# EAGLE design underwater_final (EAGLE 9.5.2)
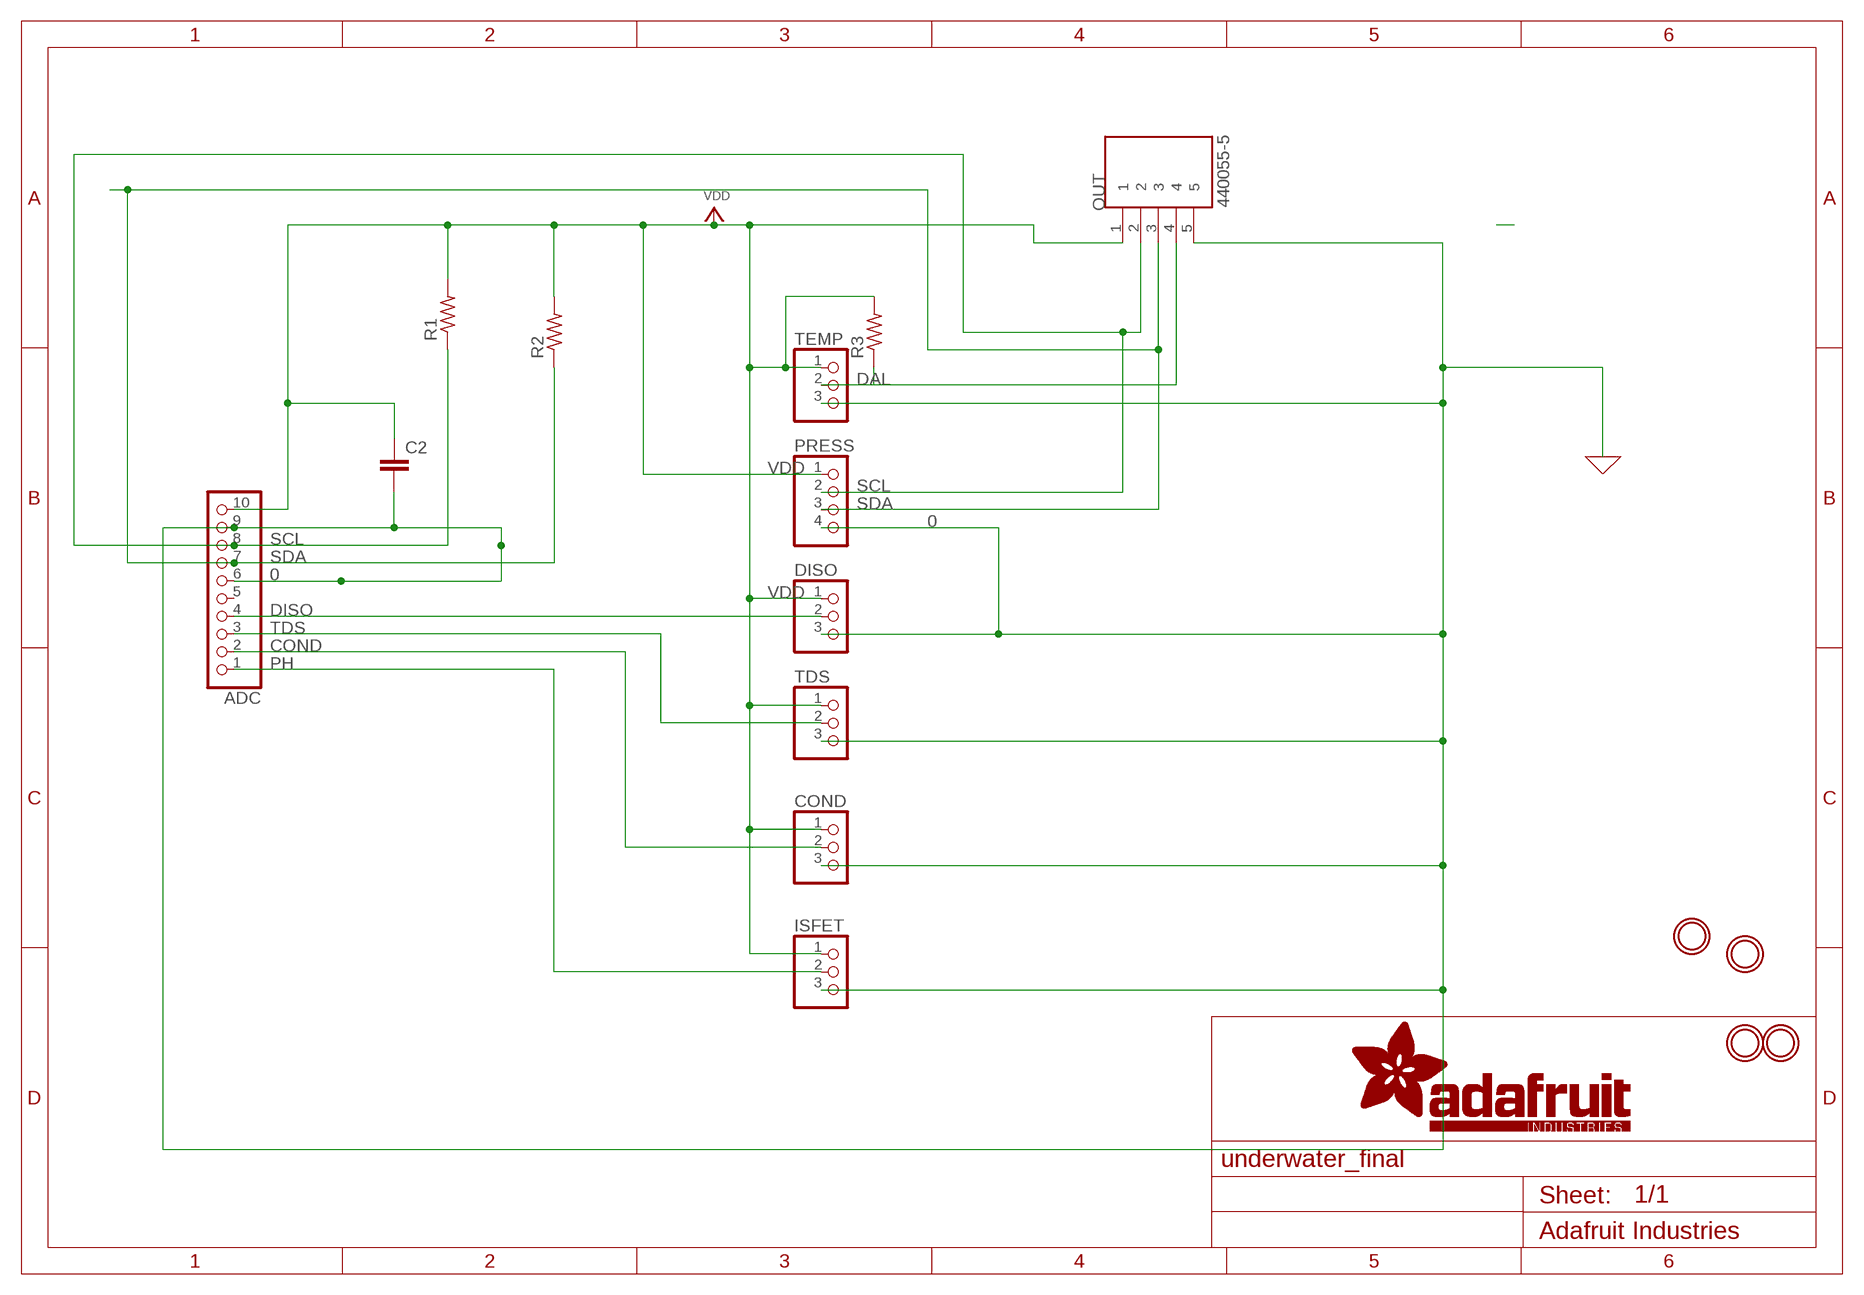
[diagram p0: schematic, sheet 1]

## Parts
ADC  HEADER-1X1070MIL  [1X10_ROUND70]
C2  C2.5/2  [C2.5-2]
COND  PINHD-1X3  [1X03]
DISO  PINHD-1X3  [1X03]
ISFET  PINHD-1X3  [1X03]
OUT  440055-5  [TE_440055-5]
PRESS  PINHD-1X4  [1X04]
R1  R-US_0204/7  [0204/7]
R2  R-US_0204/7  [0204/7]
R3  R-US_0204/7  [0204/7]
TDS  PINHD-1X3  [1X03]
TEMP  PINHD-1X3  [1X03]
U$2  MOUNTINGHOLE2.5  [MOUNTINGHOLE_2.5_PLATED]
U$3  MOUNTINGHOLE2.5  [MOUNTINGHOLE_2.5_PLATED]
U$13  MOUNTINGHOLE2.5  [MOUNTINGHOLE_2.5_PLATED]
U$14  MOUNTINGHOLE2.5  [MOUNTINGHOLE_2.5_PLATED]

## Nets
0: ADC.6 ADC.9 C2.2 COND.3 DISO.3 ISFET.3 OUT.5 PRESS.4 TDS.3 TEMP.3 ; supply symbol labelled GND
COND: ADC.2 COND.2
DAL: OUT.4 R3.1 TEMP.2
DISO: ADC.4 DISO.2
PH: ADC.1 ISFET.2
SCL: ADC.8 OUT.2 PRESS.2 R1.1
SDA: ADC.7 OUT.3 PRESS.3 R2.1
TDS: ADC.3 TDS.2
VDD: ADC.10 C2.1 COND.1 DISO.1 ISFET.1 OUT.1 PRESS.1 R1.2 R2.2 R3.2 TDS.1 TEMP.1
Unconnected: ADC.5

## Library data of the parts
ADC = microbuilder:HEADER-1X10: PIN HEADER
C2 = capacitor-wima:C: CAPACITOR naming: grid - package width
COND DISO ISFET TDS TEMP = pinhead:PINHD-1X3: PIN HEADER
OUT = 440055-5:440055-5; MANUFACTURER: TE; PARTREV: R; STANDARD: Manufacturer Recommendations
PRESS = pinhead:PINHD-1X4: PIN HEADER
R1-R3 = rcl:R-US_: RESISTOR, American symbol; SPICEPREFIX: R
U$2 U$3 U$13 U$14 = microbuilder:MOUNTINGHOLE: Mounting Hole For #2 screws (0.086"/2.18mm width, 0.094"/2.4mm hole) use 2.5mm

## Module TEMP
Ports: V+(io) V-(io) 1W(io)

### Library data of the parts

## Module TDS
Ports: V+(io) A(io) GND(io)

### Library data of the parts

## Module PRESS
Ports: SCL(io) SDA(io) V+(io) GND(io)

### Library data of the parts

## Module COND
Ports: V-(io) A(io) V+(io)

### Library data of the parts

## Module ISFET
Ports: V-(io) A(io) V+(io)

### Library data of the parts

## Module DISSO
Ports: V-(io) A(io) V+(io)

### Library data of the parts

## Module OUTBOUND
Ports: VDD(io) SDA(io) SCL(io) 1W(io) GND(io) VDDI(io) SDAI(io) SCLI(io) 1WI(io) GNDI(io)

### Library data of the parts

## Board
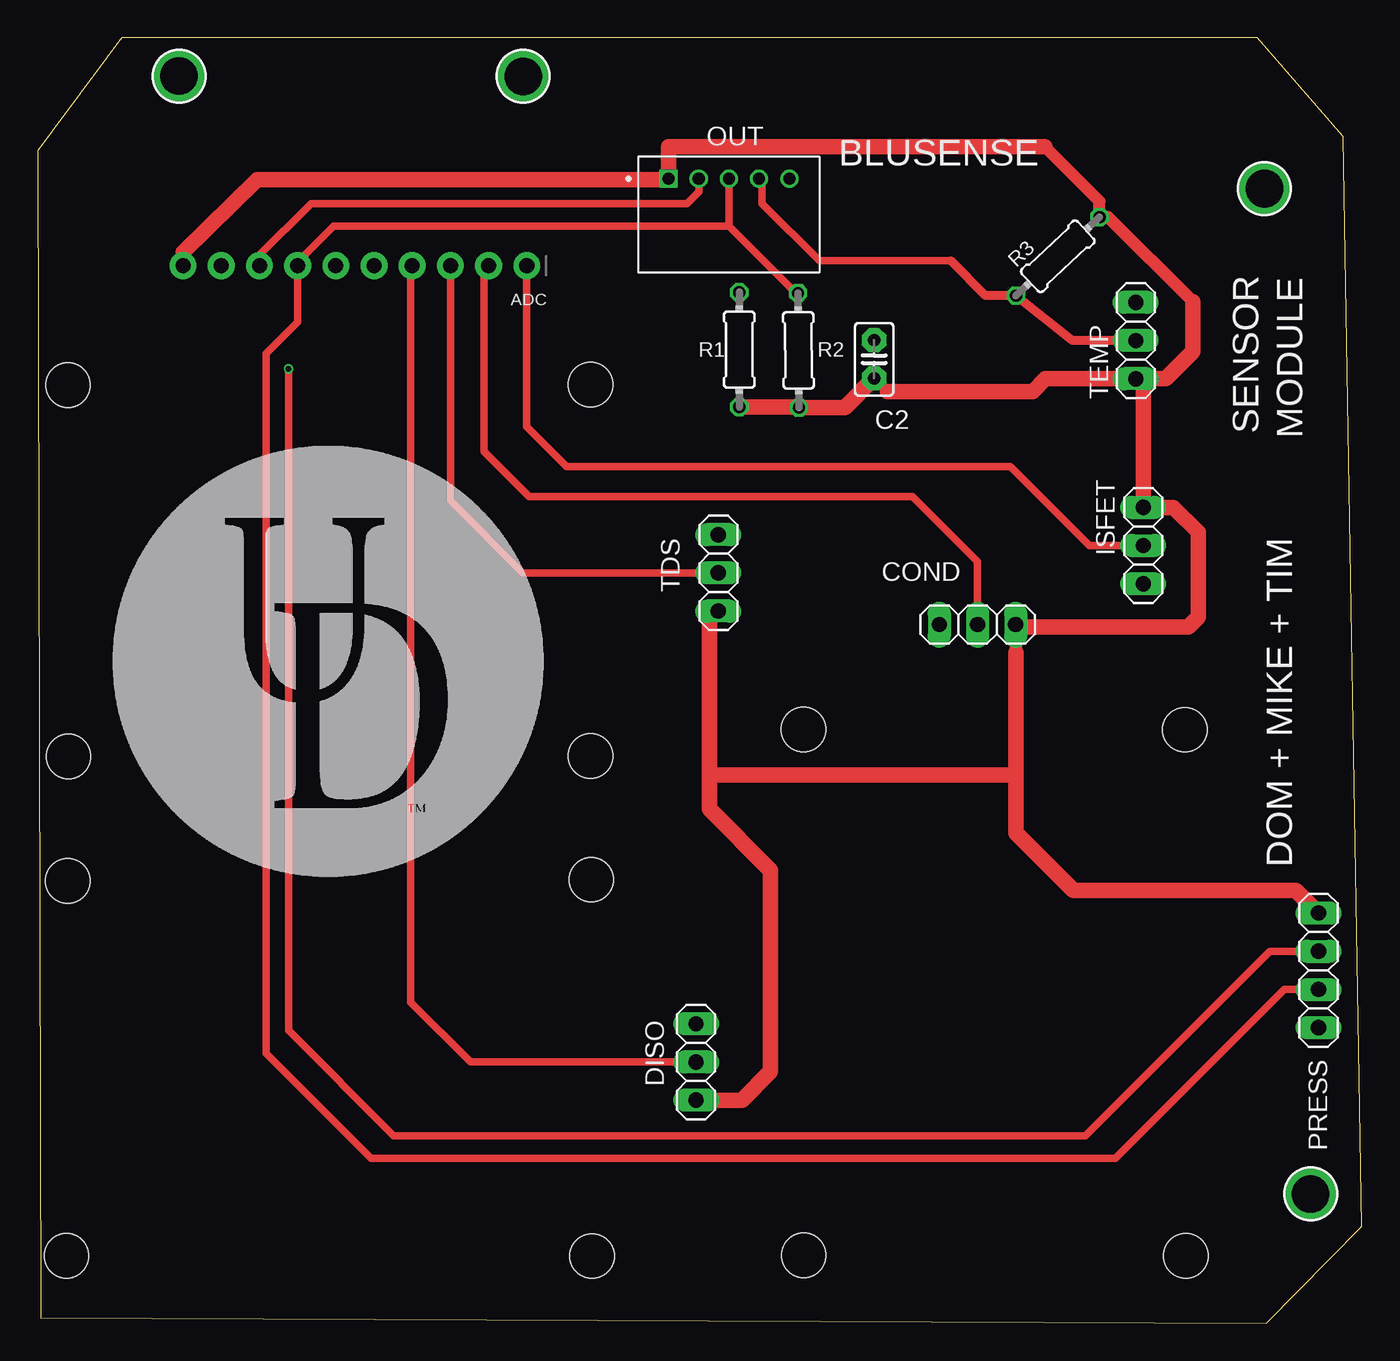
[diagram p1: board, top side]
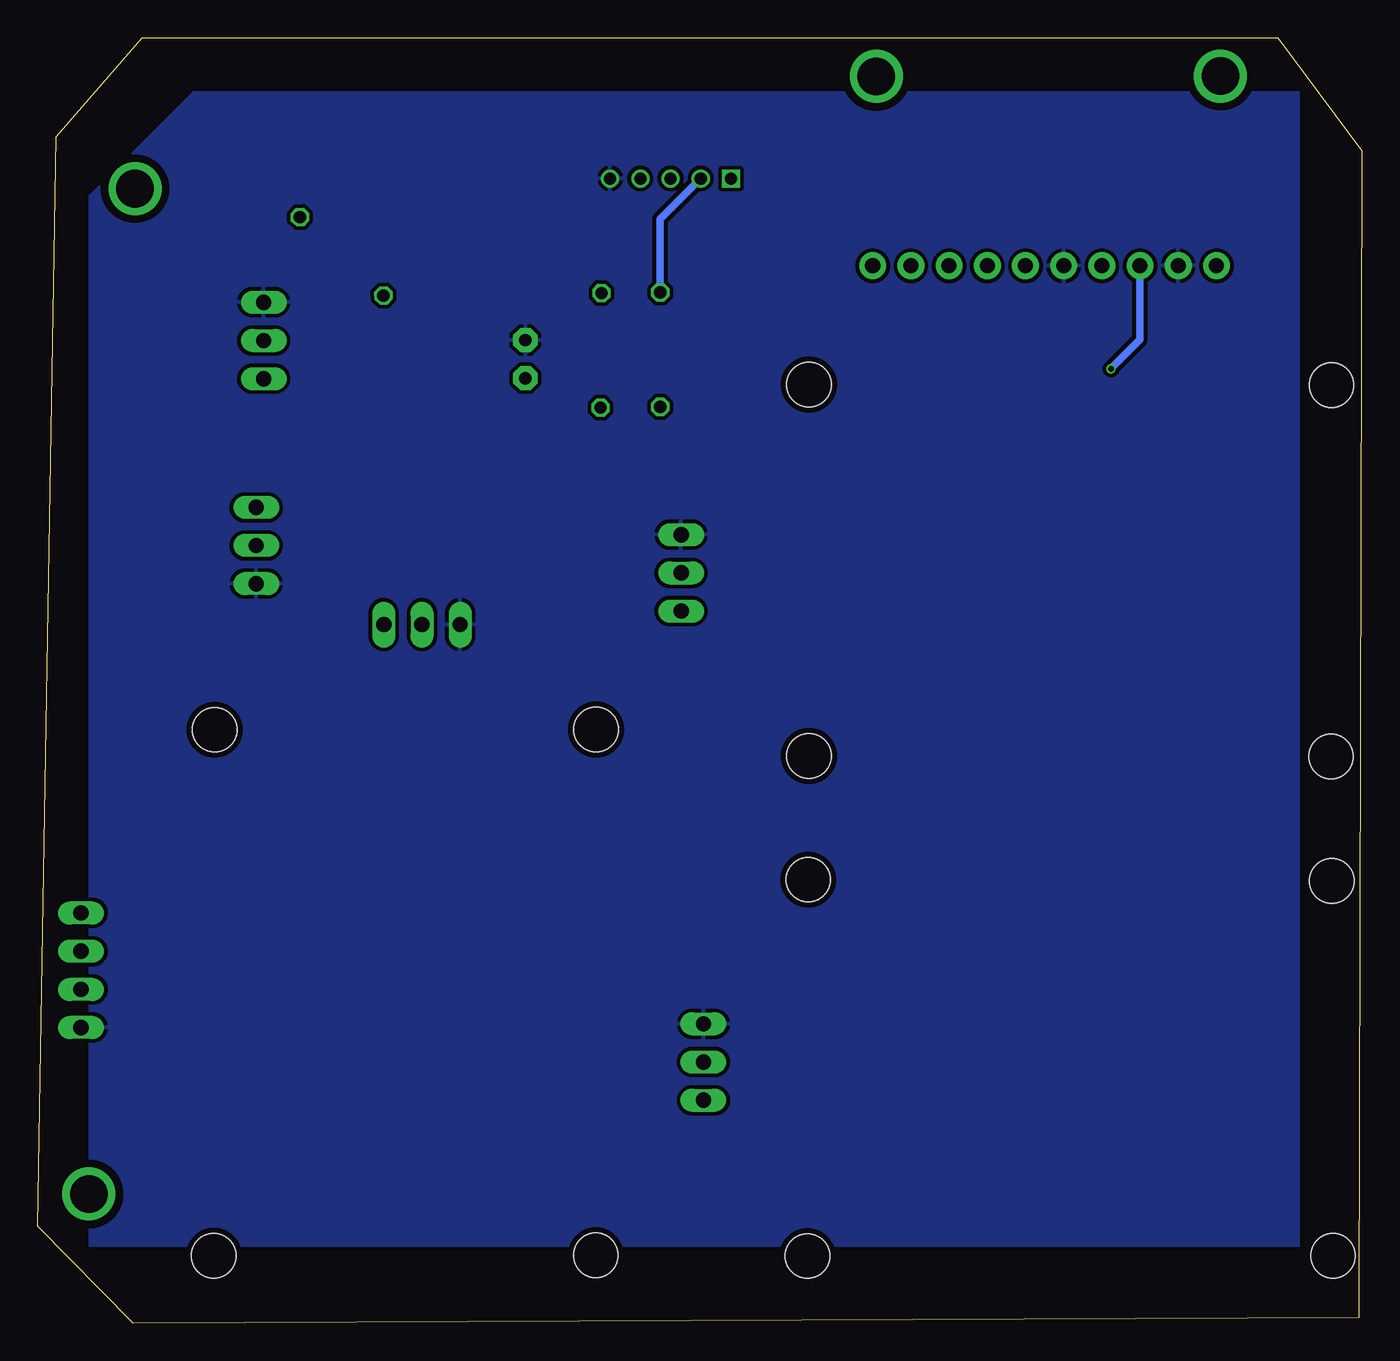
[diagram p2: board, bottom side, seen from below]

Size 88.07 x 85.49 mm. Coordinates in mm from the lower left corner, seen from the top.
Outline: 0,77.99 0.21,0.36 81.7,0 88.07,6.44 86.83,78.9 81.13,85.49 5.58,85.49 0,77.99
Copper layers (1*16): Top 0.035559375mm / dielectric 1.6mm / Bottom 0.035559375mm
Design rules "oshpark-2layer": minimum track width 6mil, minimum drill 10mil, track to track 6mil, track to pad 6mil, pad to pad 6mil, via to via 6mil, smd to smd 6mil, copper to edge 15mil, drill to drill 6mil, minimum pad ring 5mil, minimum via ring 5mil, stop-mask expansion 2.5mil, vias tented up to drill 0mil, thermal gap 10mil
Holes 2.95 mm at 2.02,62.39 2.05,37.69 36.77,37.72 36.77,62.41 2,29.41 36.82,29.49 1.92,4.49 36.87,4.46 50.95,4.51 50.93,39.49 76.35,4.49 76.3,39.46

### Footprints (pad centres in the part's own frame; a part is rotated, then mirrored left to right if it is on the bottom)
1X10_ROUND70 = drill 1 pad 1.778: 1 -11.43,0; 2 -8.89,0; 3 -6.35,0; 4 -3.81,0; 5 -1.27,0; 6 1.27,0; 7 3.81,0; 8 6.35,0; 9 8.89,0; 10 11.43,0
C2.5-2 = drill 0.813 pad 1.6 octagon: 1 -1.27,0; 2 1.27,0
1X03 = drill 1.016 long: 1 -2.54,0; 2 0,0; 3 2.54,0
TE_440055-5 = drill 0.8 pad 1.15 square: 1 0,0 | drill 0.8 pad 1.15: 2 2.007,0; 3 4.013,0; 4 6.02,0; 5 8.026,0
1X04 = drill 1.016 long: 1 -3.81,0; 2 -1.27,0; 3 1.27,0; 4 3.81,0
0204/7 = drill 0.813 octagon: 1 -3.81,0; 2 3.81,0
MOUNTINGHOLE_2.5_PLATED = drill 2.5 pad 3.2: P$1 0,0

### Placement (x,y rotation side)
ADC  21.1,70.32 180 top
C2  55.63,64.1 90 top
COND  62.51,46.46 180 top
DISO  43.79,17.37 90 top
ISFET  73.53,51.71 270 top
OUT  41.96,76.12 0 top
PRESS  85.18,23.46 270 top
R1  46.66,64.74 270 top
R2  50.6,64.69 270.5 top
R3  67.85,70.95 43.2 top
TDS  45.27,49.89 90 top
TEMP  73.03,65.34 90 top
U$2  81.59,75.44 0 top
U$3  84.66,8.59 0 top
U$13  9.4,82.93 0 top
U$14  32.29,82.91 0 top

### Tracks (layer width: path | path; a pad name or v marks a point on that pad's centre or on a via)
0
  pour Bottom (isolate 0.254): 84.62,5.15 4.2,5.15 4.2,81.85 77.73,81.85 84.62,74.96
COND
  Top 0.152: 29.68,70.01 ADC.2
  Top 0.508: COND.2 62.51,50.63 58.18,54.96 32.68,54.96 29.68,57.96 29.68,70.01
DAL
  Top 0.508: OUT.4 48.18,75.92 48.18,74.46 51.99,70.65 60.73,70.65
  Top 0.61: TEMP.2 68.82,65.34 R3.1 63.04,68.34 60.73,70.65
DISO
  Top 0.508: DISO.2 28.78,17.37 24.82,21.33 24.82,70.22 ADC.4
PH
  Top 0.508: ADC.1 32.53,59.61 35.18,56.96 64.68,56.96 69.93,51.71 ISFET.2
SCL  (via drill 0.35)
  Top 0.508: OUT.2 43.97,75.25 43.18,74.46 18.18,74.46 14.68,70.96 14.68,70.39 ADC.8 | PRESS.2 81.95,24.73 69.67,12.46 23.69,12.46 16.68,19.46 v16.68,63.46
  Bottom 0.508: OUT.2 46.66,73.43 R1.1 | v16.68,63.46 14.75,65.39 ADC.8
SDA
  Top 0.152: ADC.7 17.18,70.43
  Top 0.508: 17.18,70.43 17.18,70.46 19.68,72.96 45.98,72.96 | 45.98,72.96 OUT.3 | ADC.7 17.29,66.59 15.19,64.48 15.19,17.95 22.18,10.96 71.68,10.96 82.91,22.19 PRESS.3 | R2.1 50.44,68.5 45.98,72.96
TDS
  Top 0.508: TDS.2 32.25,49.89 27.45,54.69 ADC.3
VDD
  Top 0.152: 65.05,44.59 65.05,44.89 65.05,46.31 COND.1 | 56.5,61.96 C2.1 | TDS.1 44.68,46.76
  Top 0.813: 66.99,78.24 70.63,74.6 R3.2 71.19,73.56 76.82,67.93 | COND.1 65.05,44.89
  Top 1.016: ADC.10 9.67,71.22 14.59,76.05 41.96,76.05 OUT.1 41.96,78.24 66.99,78.24 | TEMP.1 73.53,62.3 ISFET.1 75.53,54.25 77.18,52.6 77.18,46.96 76.53,46.31 65.05,46.31 | 65.05,36.46 44.68,36.46 | DISO.1 46.83,14.83 48.76,16.75 48.76,30.11 44.68,34.19 44.68,36.46 | 76.82,67.93 76.82,64.6 75.02,62.8 TEMP.1 | TEMP.1 67.02,62.8 66.18,61.96 56.5,61.96 | PRESS.1 83.68,28.77 68.87,28.77 65.05,32.59 65.05,36.46 | 44.68,46.76 44.68,36.46 | 65.05,44.59 65.05,36.46 | R1.2 50.59,60.93 R2.2 53.68,60.88 C2.1

### Text on the board
tNames: BLUSENSE | SENSOR | MODULE | DOM + MIKE + TIM | J:/My Drive/Research/Hardware/eagle/logos/UDMonogramC.bmp
200bmp: J:/My Drive/Research/Hardware/eagle/logos/UDMonogramC.bmp